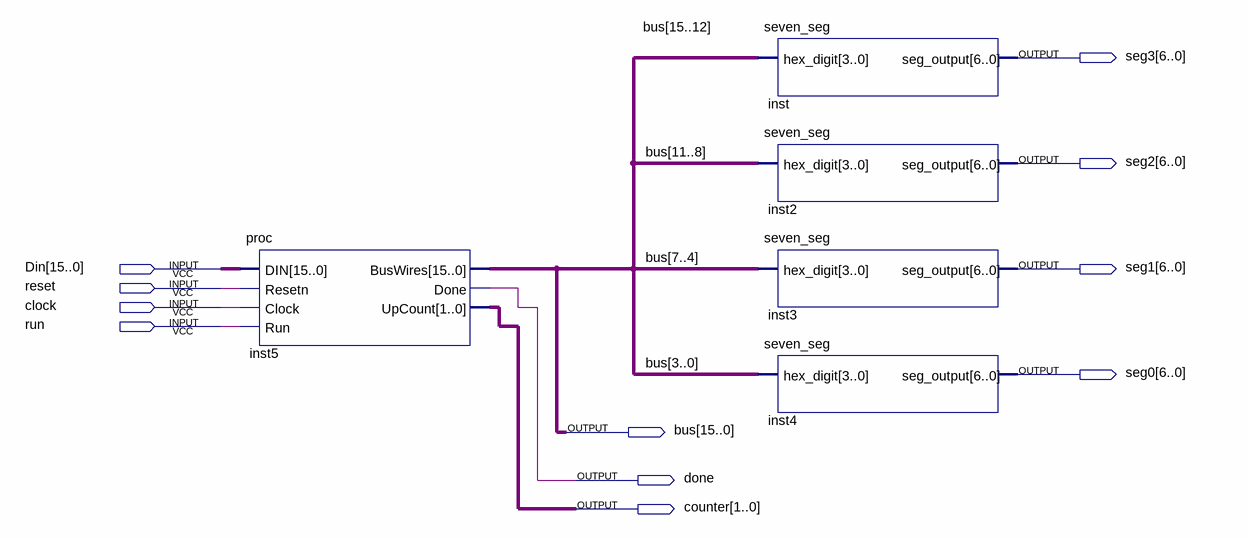
[diagram p0: schematic sheet]
// Quartus schematic multicycleCPU.bdf as structural Verilog: 5 symbols, 11 pins
module multicycleCPU (
  input  [15:0] Din,
  input  reset,
  input  clock,
  input  run,
  output [6:0] seg3,
  output [6:0] seg2,
  output [6:0] seg1,
  output [6:0] seg0,
  output [15:0] bus,
  output done,
  output [1:0] counter
);

  proc inst5 (.DIN(Din), .Resetn(reset), .Clock(clock), .Run(run), .BusWires(bus), .Done(done), .UpCount(counter));
  seven_seg inst (.hex_digit(bus[15:12]), .seg_output(seg3));
  seven_seg inst2 (.hex_digit(bus[11:8]), .seg_output(seg2));
  seven_seg inst3 (.hex_digit(bus[7:4]), .seg_output(seg1));
  seven_seg inst4 (.hex_digit(bus[3:0]), .seg_output(seg0));
endmodule
